# EAGLE schematic sensact_eagle_2.0g (EAGLE 7.5.0)
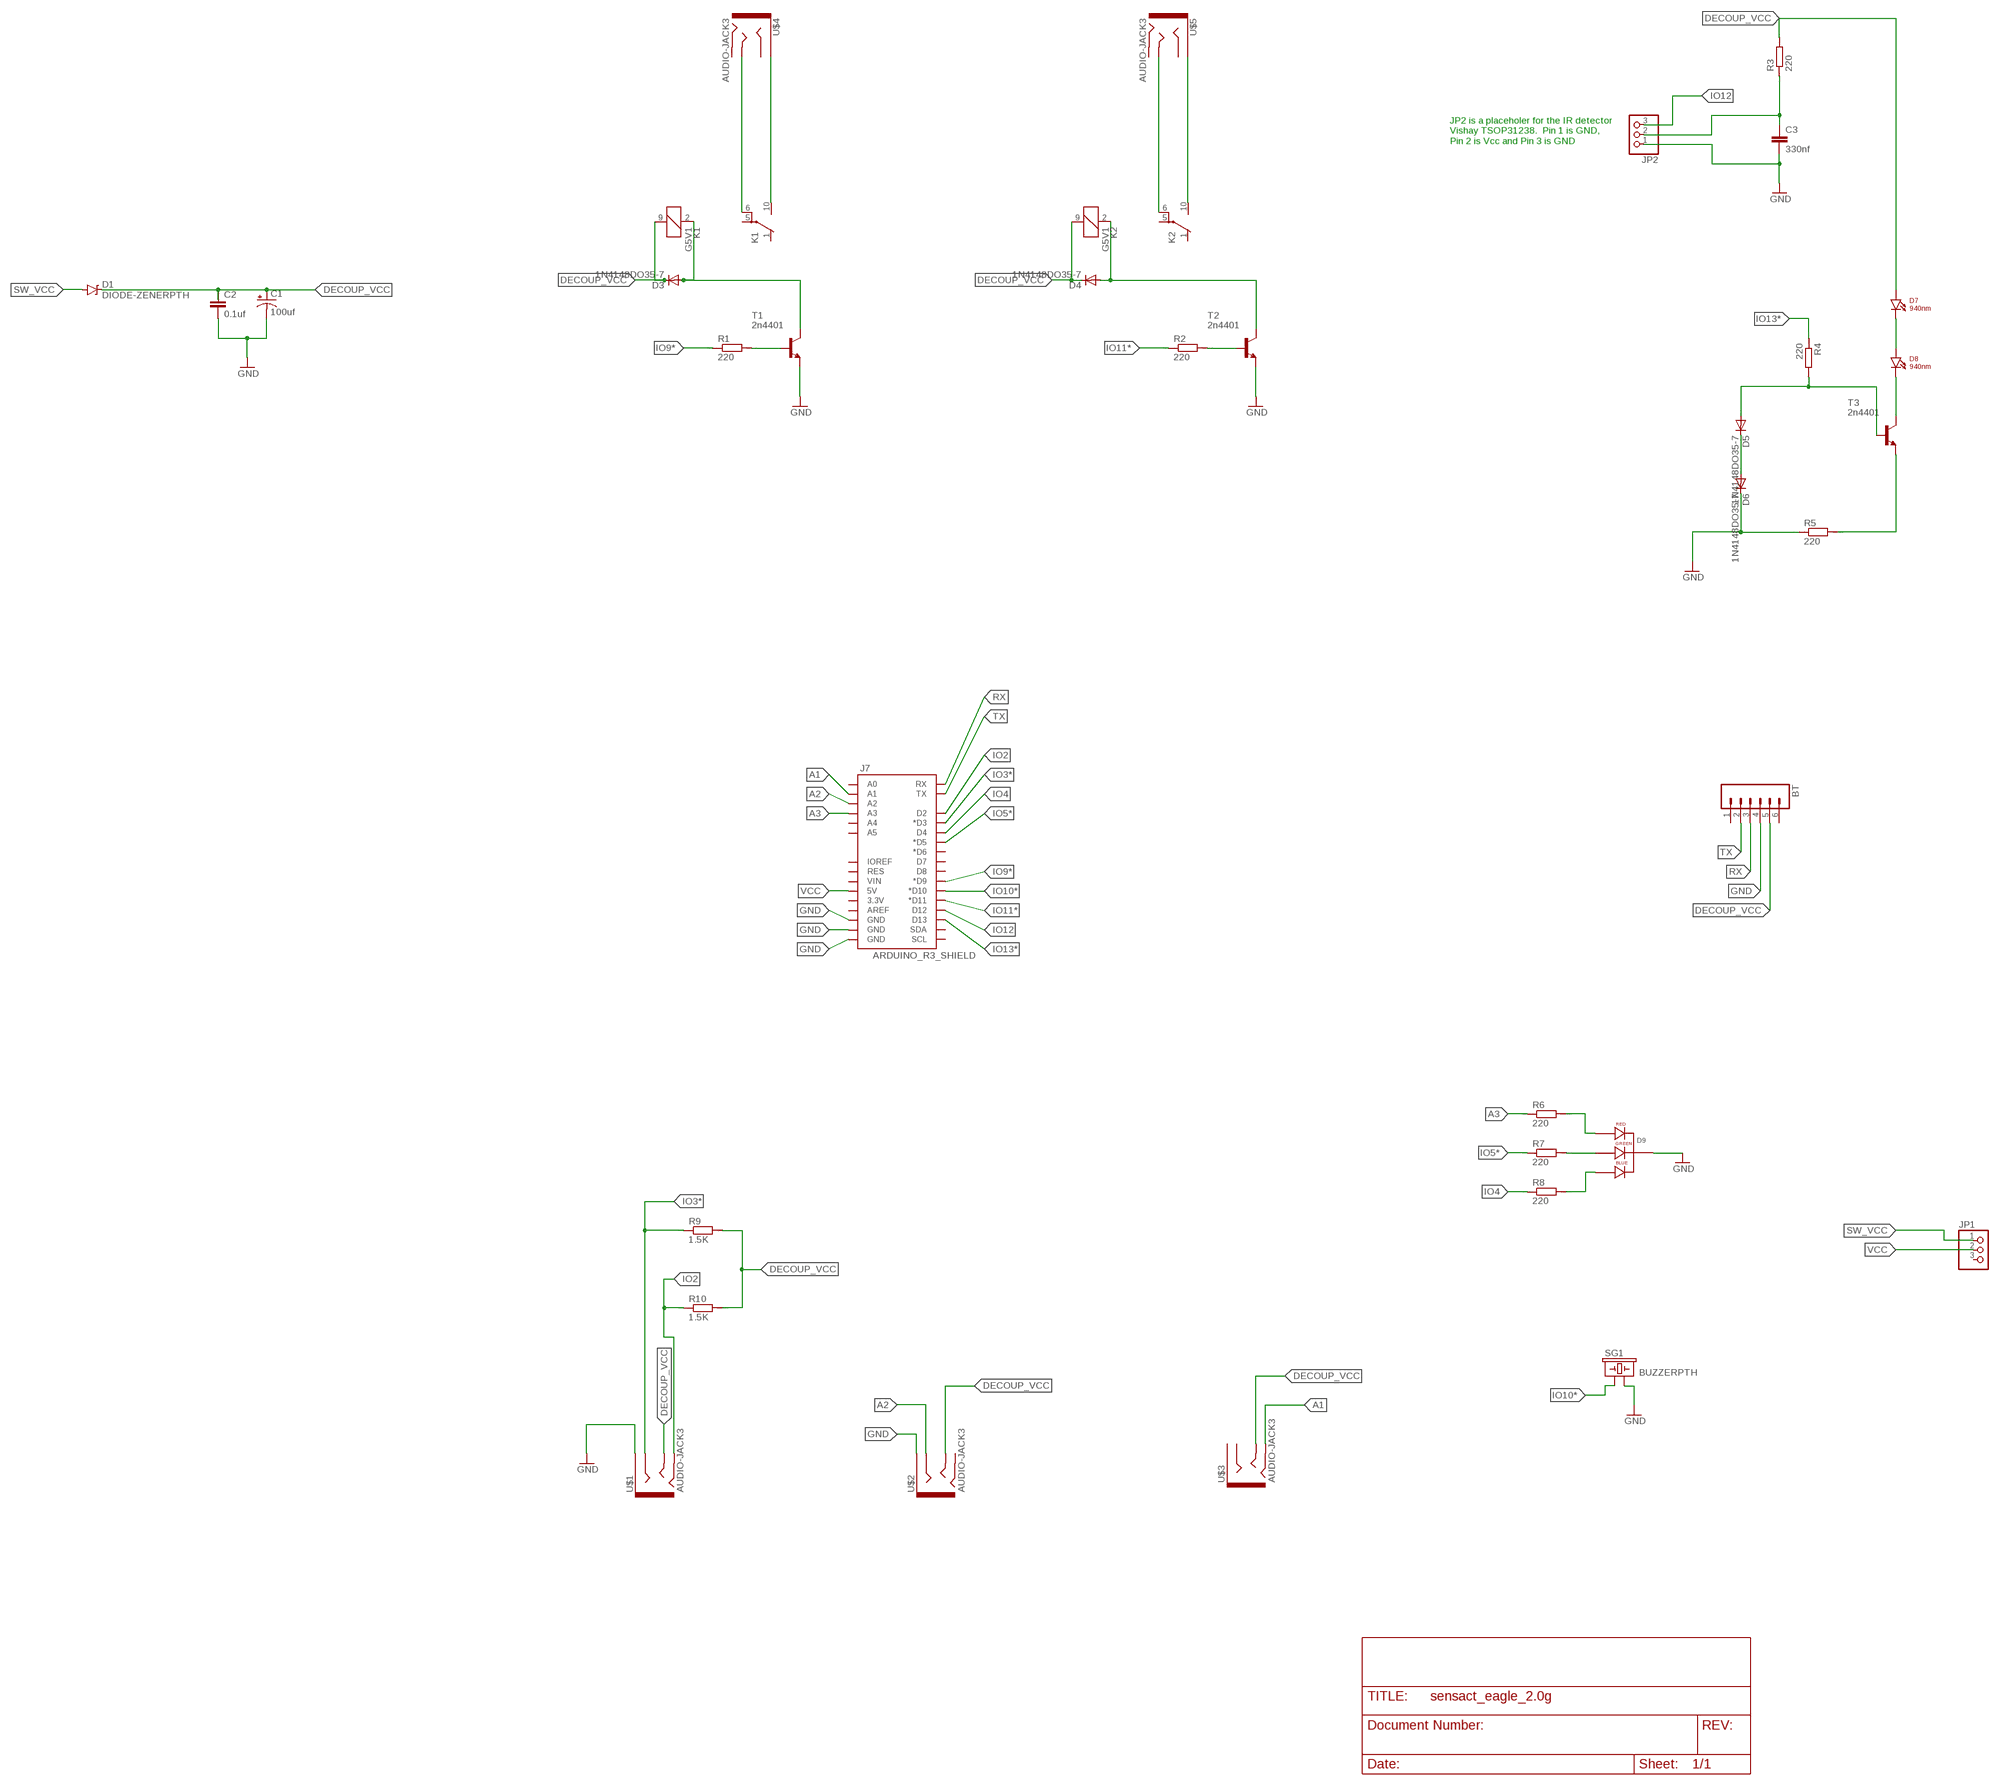
[diagram p0: schematic, sheet 1]

## Parts
BT  M06NO_SILK_FEMALE_PTH  [1X06_NO_SILK]
C1  100uf  CAP_POLPTH1  [CPOL-RADIAL-100UF-25V]
C2  0.1uf  CAPEZ  [CAP-PTH-SMALLEZ]
C3  330nf  CAPEZ  [CAP-PTH-SMALLEZ]
D1  DIODE-ZENERPTH  [DIODE-ZENER]
D3  1N4148DO35-7  [DO35-7]
D4  1N4148DO35-7  [DO35-7]
D5  1N4148DO35-7  [DO35-7]
D6  1N4148DO35-7  [DO35-7]
D7  940nm  LTE-302  [LTE-302]
D8  940nm  LTE-302  [LTE-302]
D9  OFFSET_RGB_LED_CCOFFSET_RGB_LED_THRU  [OFFSET_RGB_THRU]
J7  ARDUINO_R3_SHIELD  [UNO_R3_SHIELD]
JP1  PINHD-1X3  [1X03]
JP2  PINHD-1X3  [1X03]
K1  G5V1  [G5V1]
K2  G5V1  [G5V1]
R1  220  R0204/7  [0204/7]
R2  220  R0204/7  [0204/7]
R3  220  R0204/7  [0204/7]
R4  220  R0204/7  [0204/7]
R5  220  R0204/7  [0204/7]
R6  220  R0204/7  [0204/7]
R7  220  R0204/7  [0204/7]
R8  220  R0204/7  [0204/7]
R9  1.5K  R0204/7  [0204/7]
R10  1.5K  R0204/7  [0204/7]
SG1  BUZZERPTH  [BUZZER-12MM]
T1  2n4401  2N4401-NPN-TO92-EBC  [TO92-EBC]
T2  2n4401  2N4401-NPN-TO92-EBC  [TO92-EBC]
T3  2n4401  2N4401-NPN-TO92-EBC  [TO92-EBC]
U$1  AUDIO-JACK3  [AUDIO-JACK-TRRS-SMD]
U$2  AUDIO-JACK3  [AUDIO-JACK-TRRS-SMD]
U$3  AUDIO-JACK3  [AUDIO-JACK-TRRS-SMD]
U$4  AUDIO-JACK3  [AUDIO-JACK-TRRS-SMD]
U$5  AUDIO-JACK3  [AUDIO-JACK-TRRS-SMD]

## Nets
A1: J7.A1 U$3.RING2
A2: J7.A2 U$2.RING1
A3: J7.A3 R6.1
DECOUP_VCC: BT.5 C1.1(+) C2.1 D1.P$1(C) D3.C D4.C D7.A K1.9 K2.9 R3.2 R9.2 R10.2 U$1.TIP U$2.TIP U$3.TIP
GND: BT.4 C1.2(-) C2.2 C3.2 D6.C D9.2(CATHODE) J7.GND@0(GND) J7.GND@1(GND) J7.GND@2(GND) JP2.1 R5.1 SG1.- T1.E T2.E U$1.EARTH U$2.EARTH
IO2: J7.D2 R10.1 U$1.RING2
IO3*: J7.D3(*D3) R9.1 U$1.RING1
IO4: J7.D4 R8.1
IO5*: J7.D5(*D5) R7.1
IO9*: J7.D9(*D9) R1.1
IO10*: J7.D10(*D10) SG1.+
IO11*: J7.D11(*D11) R2.1
IO12: J7.D12 JP2.3
IO13*: J7.D13 R4.1
N$1: K1.6(2:P) U$4.TIP
N$2: K1.10(2:S) U$4.EARTH
N$3: K2.6(2:P) U$5.TIP
N$4: K2.10(2:S) U$5.EARTH
N$5: D4.A K2.2 T2.C
N$7: D3.A K1.2 T1.C
N$9: R1.2 T1.B
N$10: R2.2 T2.B
N$11: C3.1 JP2.2 R3.1
N$12: D7.C D8.A
N$13: D8.C T3.C
N$14: D5.A R4.2 T3.B
N$15: R5.2 T3.E
N$17: D9.3(GREEN_CATHODE) R7.2
N$18: D5.C D6.A
N$19: D9.1(RED_CATHODE) R6.2
N$20: D9.4(BLUE_CATHODE) R8.2
RX: BT.3 J7.RX
SW_VCC: D1.P$2(A) JP1.1
TX: BT.2 J7.TX
VCC: J7.5V JP1.2
Unconnected: BT.1 BT.6 J7.3.3V J7.A0 J7.A4 J7.A5 J7.AREF J7.D6(*D6) J7.D7 J7.D8 J7.IOREF J7.RES J7.SCL J7.SDA J7.VIN JP1.3 K1.1(2:O) K1.5(2:P) K2.1(2:O) K2.5(2:P) U$2.RING2 U$3.EARTH U$3.RING1 U$4.RING1 U$4.RING2 U$5.RING1 U$5.RING2

## Notes on the sheet
- JP2 is a placeholer for the IR detector
  Vishay TSOP31238.  Pin 1 is GND,
  Pin 2 is Vcc and Pin 3 is GND

## Library data of the parts
BT = SparkFun-Connectors:M06: Header 6 Standard 6-pin 0.1" header. Use with straight break away headers (SKU : PRT-00116), right angle break away headers (PRT-00553), swiss pins (PRT-00743), machine pins (PRT-00117), and female headers (PRT-00115). Molex polarized connector foot print use with SKU : PRT-08094 with associated crimp pins and housings. NOTES ON THE VARIANTS LOCK and LOCK_LONGPADS... This footprint was designed to help hold the alignment of a through-hole component (i.e. 6-pin header) while soldering it into place. You may notice that each hole has been shifted either up or down by 0.005 of an inch from it's more standard position (which is a perfectly straight line). This slight alteration caused the pins (the squares in the middle) to touch the edges of the holes. Because they are alternating, it causes a "brace" to hold the component in place. 0.005 has proven to be the perfect amount of "off-center" position when using our standard breakaway headers. Although looks a little odd when you look at the bare footprint, once you have a header in there, the alteration is very hard to notice. Also,if you push a header all the way into place, it is covered up entirely on the bottom side. This idea of altering the position of holes to aid alignment will be further integrated into the Sparkfun Library for other footprints. It can help hold any component with 3 or more connection pins.; PROD_ID: CONN-08437
C1 = SparkFun-Capacitors:CAP_POL: Capacitor Polarized These are standard SMD and PTH capacitors. Normally 10uF, 47uF, and 100uF in electrolytic and tantalum varieties. Always verify the external diameter of the through hole cap, it varies with capacity, voltage, and manufacturer. The EIA devices should be standard.
C2 C3 = SparkFun-Capacitors:CAP: Capacitor Standard 0603 ceramic capacitor, and 0.1" leaded capacitor.
D1 = SparkFun-DiscreteSemi:DIODE-ZENER: Zener Diode Production Part - 8199 3.4V Zener Voltage
D3-D6 = diode:1N4148: DIODE high speed (Philips)
D7 D8 = SparkFun-LED:LTE-302: Through-hole side-firing 940nm IR LED
D9 = bruce:OFFSET_RGB_LED_CC: RGB LED Thru hole Offset pins Common Cathode
J7 = SparkFun-Boards:ARDUINO_R3_SHIELD: Shield form compatible with the Arduino Uno R3.
JP1 JP2 = adafruit:PINHD-1X3: PIN HEADER
K1 K2 = relay:G5V1: RELAY 1 x switch, 0.5 A/125 V AC, 1 A/24 V DC , Omron; MPN: G5V-1-DC24; OC_FARNELL: 9949593; OC_NEWARK: 36M6377
R1-R10 = eagle-ltspice:R: RESISTOR, European symbol; SPICEMODEL: NONE; SPICEPREFIX: R
SG1 = SparkFun-Electromechanical:BUZZER: Buzzer 12mm Spark Fun Electronics SKU : Comp-Buzzer
T1-T3 = transistor-neu-to92:*-NPN-: NPN Transistror
U$1-U$5 = SparkFun-Connectors:AUDIO-JACK3: Audio jack - 3.5mm TRRS variety - two rings.

## Net classes
0 default: width 0.305 mm, drill 0.508 mm, clearance 0.254 mm